# Altium schematic sheet esp32.SchDoc
size A4; SheetNumber: 2; SheetTotal: 3
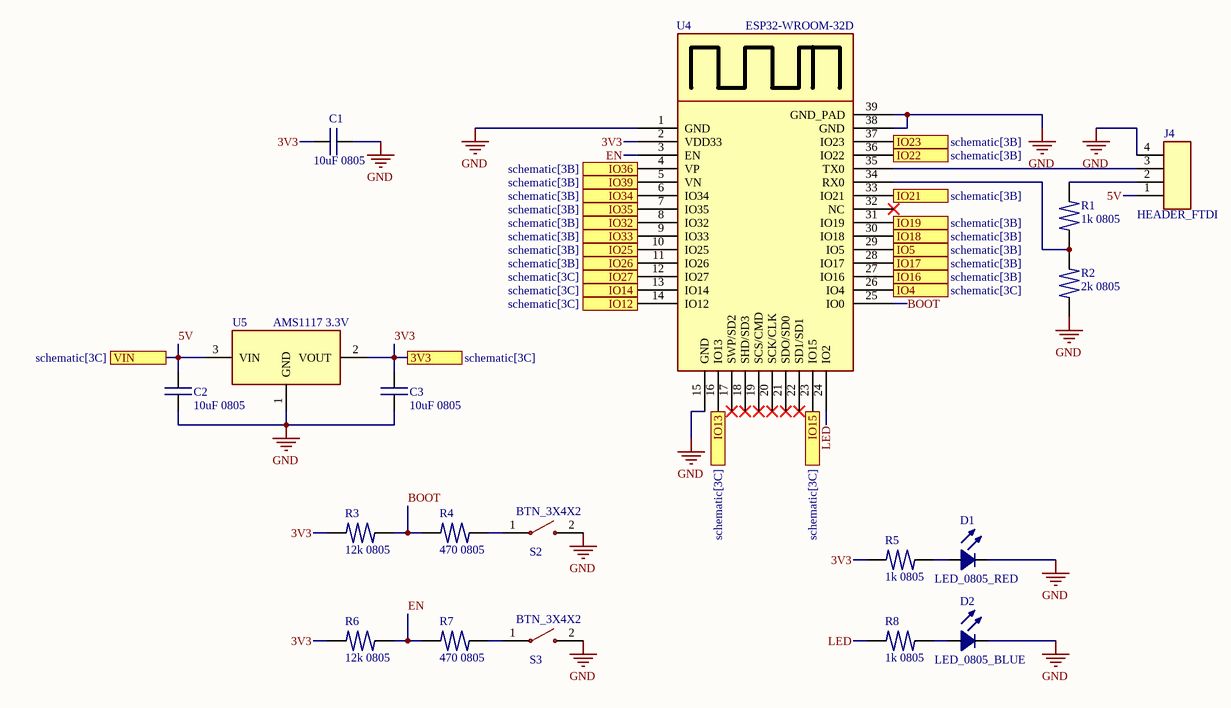
[diagram p0: esp32.SchDoc]

## Parts
C1  10uF 0805  [CAPACITOR 0805]
C2  10uF 0805  [CAPACITOR 0805]
C3  10uF 0805  [CAPACITOR 0805]
D1  LED_0805_RED  [LED_0805_RED]
D2  LED_0805_BLUE  [LED_0805_BLUE]
J4  HEADER_FTDI  [MALE-2.54-4P]
R1  1k 0805  [RESISTOR_0805]
R2  2k 0805  [RESISTOR_0805]
R3  12k 0805  [RESISTOR_0805]
R4  470 0805  [RESISTOR_0805]
R5  1k 0805  [RESISTOR_0805]
R6  12k 0805  [RESISTOR_0805]
R7  470 0805  [RESISTOR_0805]
R8  1k 0805  [RESISTOR_0805]
S2  BTN_3X4X2  [PUSH_BUTTON_SMD_3X4X2]
S3  BTN_3X4X2  [PUSH_BUTTON_SMD_3X4X2]
U4  ESP32-WROOM-32D  [ESP32-WROOM-32D]
U5  AMS1117 3.3V  [AMS1117]

## Ports
3V3 (see schematic[3C]), IO4 (see schematic[3C]), IO5 (see schematic[3B]), IO12 (see schematic[3C]), IO13 (see schematic[3C]), IO14 (see schematic[3C]), IO15 (see schematic[3C]), IO16 (see schematic[3B]), IO17 (see schematic[3B]), IO18 (see schematic[3B]), IO19 (see schematic[3B]), IO21 (see schematic[3B]), IO22 (see schematic[3B]), IO23 (see schematic[3B]), IO25 (see schematic[3B]), IO26 (see schematic[3B]), IO27 (see schematic[3C]), IO32 (see schematic[3B]), IO33 (see schematic[3B]), IO34 (see schematic[3B]), IO35 (see schematic[3B]), IO36 (see schematic[3B]), IO39 (see schematic[3B]), VIN (see schematic[3C])

## Nets
GND: C1.2 C2.1 C3.1 D1.2 D2.2 J4.4 R2.1 S2.2 S3.2 U4.1(GND) U4.15(GND) U4.38(GND) U4.39(GND_PAD) U5.1(GND)
3V3: C1.1 C3.2 R3.2 R5.2 R6.2 U4.2(VDD33) U5.2(VOUT) ; port 3V3
5V: C2.2 J4.1 U5.3(VIN) ; port VIN
BOOT: R3.1 R4.2 U4.25(IO0)
EN: R6.1 R7.2 U4.3(EN)
IO4: U4.26(IO4) ; port IO4
IO5: U4.29(IO5) ; port IO5
IO12: U4.14(IO12) ; port IO12
IO13: U4.16(IO13) ; port IO13
IO14: U4.13(IO14) ; port IO14
IO15: U4.23(IO15) ; port IO15
IO16: U4.27(IO16) ; port IO16
IO17: U4.28(IO17) ; port IO17
IO18: U4.30(IO18) ; port IO18
IO19: U4.31(IO19) ; port IO19
IO21: U4.33(IO21) ; port IO21
IO22: U4.36(IO22) ; port IO22
IO23: U4.37(IO23) ; port IO23
IO25: U4.10(IO25) ; port IO25
IO26: U4.11(IO26) ; port IO26
IO27: U4.12(IO27) ; port IO27
IO32: U4.8(IO32) ; port IO32
IO33: U4.9(IO33) ; port IO33
IO34: U4.6(IO34) ; port IO34
IO35: U4.7(IO35) ; port IO35
IO36: U4.4(VP) ; port IO36
IO39: U4.5(VN) ; port IO39
LED: R8.1 U4.24(IO2)
NetD1_1: D1.1 R5.1
NetD2_1: D2.1 R8.2
NetJ4_2: J4.2 R1.2
NetJ4_3: J4.3 U4.35(TX0)
NetR1_1: R1.1 R2.2 U4.34(RX0)
NetR4_1: R4.1 S2.1
NetR7_1: R7.1 S3.1

Not connected (* = marked no-connect by the designer): U4 17(SWP/SD2)* 18(SHD/SD3)* 19(SCS/CMD)* 20(SCK/CLK)* 21(SDO/SD0)* 22(SD1/SD1)* 32(NC)*

## Library data of the parts
C1-C3 = CAPACITOR 0805: Generic Capacitor 0805, 2x1.25x1.4mm.
J4 = MALE-2.54-4P: Male Header Connector 2.54mm 4 Pins.
R1 R2 R5 = RESISTOR_0805: Resistor SMD 0805 (1K); ComponentLink1Description: 10 PCS Resistor 1K; ComponentLink1URL: https://produto.mercadolivre.com.br/MLB-2624098004-1k-10-pecas-resistor-smd-0603-1k-ohms-1-16mmx08mm-_JM?matt_tool=63064967&matt_word=&matt_source=google&matt_campaign_id=14303413826&matt_ad_group_id=133431076203&matt_match_type=&matt_network=g&matt_device=c&matt_creative=584156655540&matt_keyword=&matt_ad_position=&matt_ad_type=pla&matt_merchant_id=215007955&matt_product_id=MLB2624098004&matt_product_partition_id=310365260760&matt_target_id=pla-310365260760&gclid=Cj0KCQiApKagBhC1ARIsAFc7Mc7UQciQkVF-VTYia6baZ8vnIuAOrlsCxaI4DIfsp2-v7xKfM_1xYSMaAsqLEALw_wcB
R3 R4 R6-R8 = RESISTOR_0805
S2 S3 = PUSH_BUTTON_SMD_3X4X2: Push Button Tactile Switch SMD 2 Pins 3x4x2mm.; JLCPCB PN: C231644
U4 = ESP32-WROOM-32D: Chip SMD 39 Pads Wifi 2.4GHz BLE 4.2 18x25.5mm w/ Antenna.; Mouser PN: ESP32-WROOM-32D-N4; Digikey PN: 1965-ESP32-WROOM-32D-N8CT-ND; ComponentLink1Description: Datasheet; ComponentLink1URL: https://www.mouser.com/datasheet/2/891/esp32_wroom_32d_esp32_wroom_32u_datasheet_en-1365844.pdf; JLCPCB PN: C82899
U5 = AMS1117: IC REG LINEAR 1A SOT-89-3L; ComponentLink1Description: Datasheet; ComponentLink1URL: http://www.advanced-monolithic.com/pdf/ds1117.pdf; Digikey PN: 4518-AMS1117-3.3CT-ND; JLCPCB PN: C963410